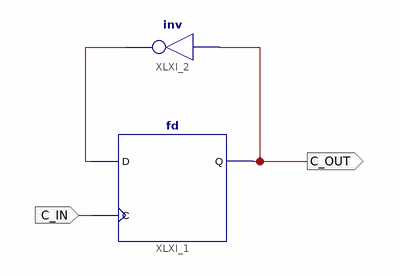
[diagram p0: schematic sheet 1]
// Xilinx ISE schematic CLK_DIV_2.sch (spartan6) as structural Verilog: 2 symbols, 2 ports
module CLK_DIV_2 (
  input  C_IN,
  output C_OUT
);

  wire XLXN_2;

  fd XLXI_1 (.C(C_IN), .D(XLXN_2), .Q(C_OUT));
  not XLXI_2 (XLXN_2, C_OUT);
endmodule
